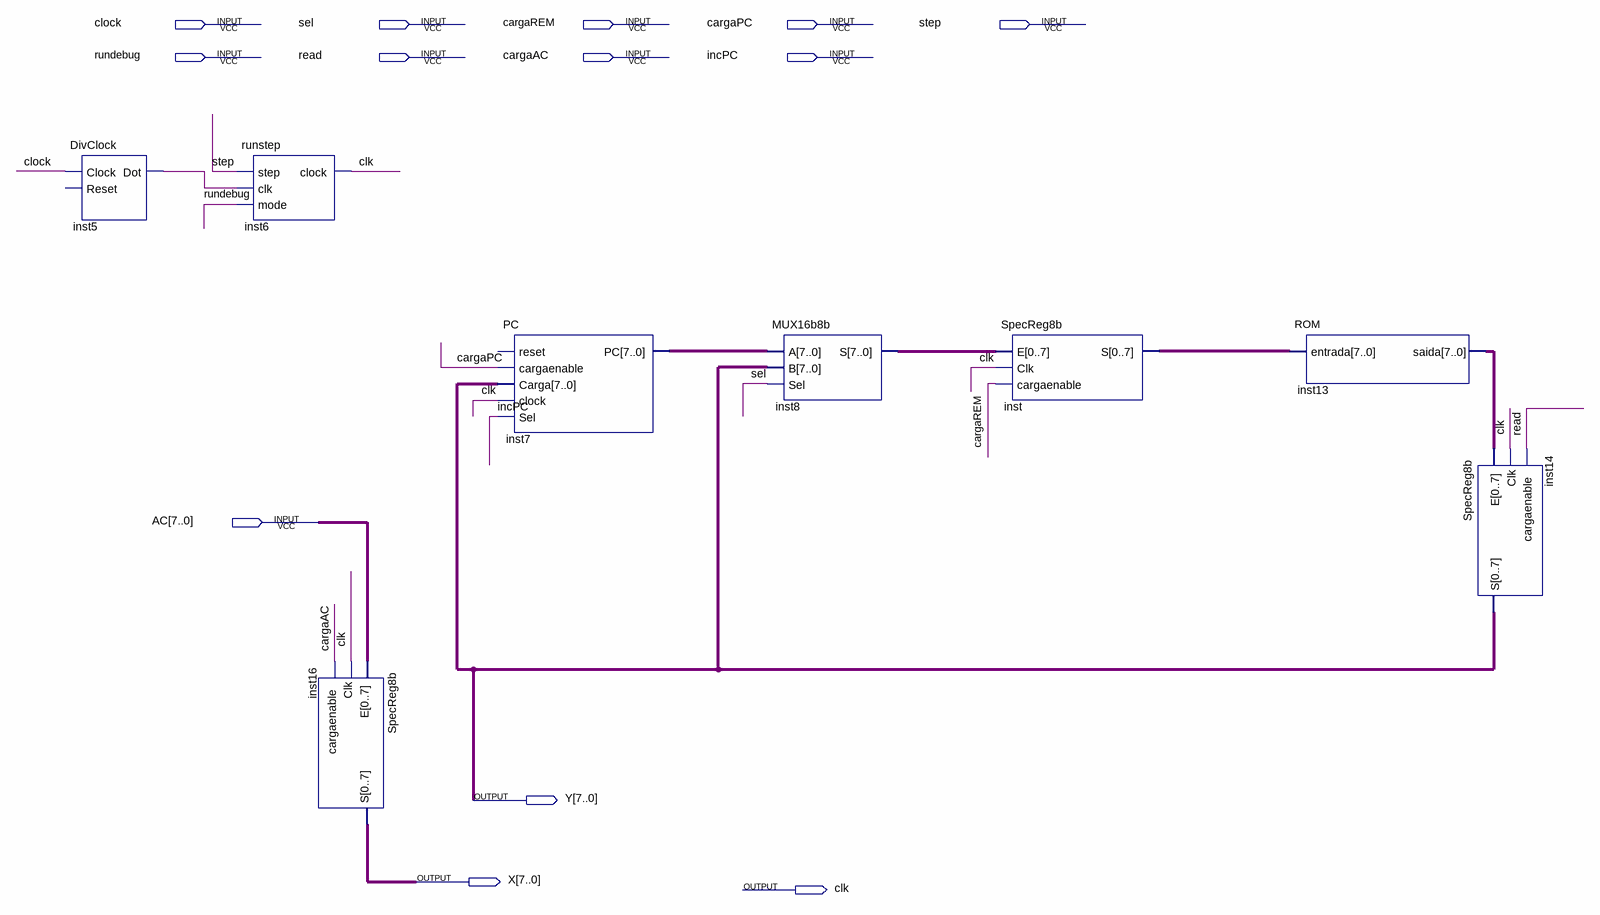
[diagram p0: schematic sheet]
// Quartus schematic NeanderSecondHalf.bdf as structural Verilog: 8 symbols, 13 pins
module NeanderSecondHalf (
  input  clock,
  input  sel,
  input  cargaREM,
  input  cargaPC,
  input  step,
  input  rundebug,
  input  read,
  input  cargaAC,
  input  incPC,
  input  [7:0] AC,
  output [7:0] Y,
  output [7:0] X,
  output clk
);

  wire inst5_dot;
  wire [7:0] inst7_pc, inst8_s, inst13_saida, inst_s;

  DivClock inst5 (.Clock(clock), .Dot(inst5_dot));  // open: Reset
  runstep inst6 (.step(step), .clk(inst5_dot), .mode(rundebug), .clock(clk));
  SpecReg8b inst16 (.E(AC), .Clk(clk), .cargaenable(cargaAC), .S(X));
  PC inst7 (.cargaenable(cargaPC), .Carga(Y), .clock(clk), .Sel(incPC), .PC(inst7_pc));  // open: reset
  MUX16b8b inst8 (.A(inst7_pc), .B(Y), .Sel(sel), .S(inst8_s));
  SpecReg8b inst (.E(inst8_s), .Clk(clk), .cargaenable(cargaREM), .S(inst_s));
  ROM inst13 (.entrada(inst_s), .saida(inst13_saida));
  SpecReg8b inst14 (.E(inst13_saida), .Clk(clk), .cargaenable(read), .S(Y));
endmodule
